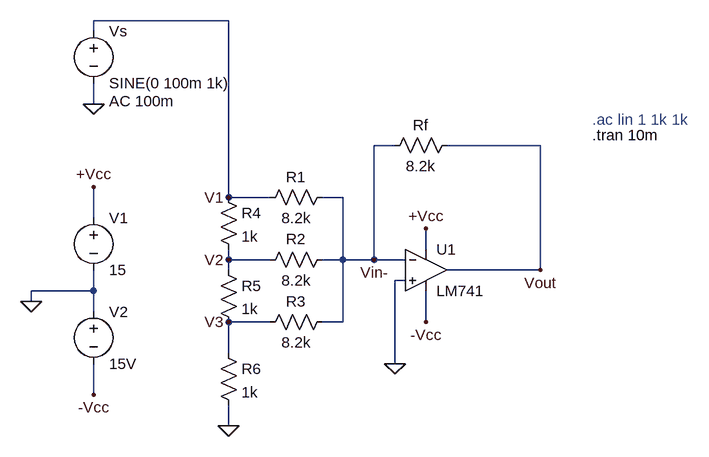
[diagram p0: schematic Adder.asc]
Adder.asc, the LTspice schematic file:
Version 4
SHEET 1 880 680
WIRE -32 -176 -240 -176
WIRE -240 -160 -240 -176
WIRE -240 -48 -240 -80
WIRE 224 16 192 16
WIRE 448 16 304 16
WIRE -32 96 -32 -176
WIRE 32 96 -32 96
WIRE 144 96 112 96
WIRE -240 128 -240 80
WIRE 272 176 272 144
WIRE -32 192 -32 176
WIRE 32 192 -32 192
WIRE 144 192 144 96
WIRE 144 192 112 192
WIRE 192 192 192 16
WIRE 192 192 144 192
WIRE 240 192 192 192
WIRE -32 208 -32 192
WIRE 448 208 448 16
WIRE 448 208 304 208
WIRE 240 224 224 224
WIRE -240 240 -240 208
WIRE -240 240 -336 240
WIRE -336 256 -336 240
WIRE -240 272 -240 240
WIRE 32 288 -32 288
WIRE 144 288 144 192
WIRE 144 288 112 288
WIRE 272 288 272 240
WIRE -32 336 -32 288
WIRE 224 352 224 224
WIRE -240 400 -240 352
WIRE -32 448 -32 416
FLAG -336 256 0
FLAG -240 80 +Vcc
FLAG 272 144 +Vcc
FLAG -240 400 -Vcc
FLAG 272 288 -Vcc
FLAG 448 208 Vout
FLAG 192 192 Vin-
FLAG 224 352 0
FLAG -32 448 0
FLAG -240 -48 0
FLAG -32 96 V1
FLAG -32 192 V2
FLAG -32 288 V3
SYMBOL Opamps\\LM741 272 144 R0
SYMATTR InstName U1
SYMBOL res 320 0 R90
WINDOW 0 0 56 VBottom 2
WINDOW 3 32 56 VTop 2
SYMATTR InstName Rf
SYMATTR Value 8.2k
SYMBOL res 128 176 R90
WINDOW 0 0 56 VBottom 2
WINDOW 3 32 56 VTop 2
SYMATTR InstName R2
SYMATTR Value 8.2k
SYMBOL voltage -240 -176 R0
WINDOW 123 24 124 Left 2
WINDOW 39 0 0 Left 0
SYMATTR Value2 AC 100m
SYMATTR InstName Vs
SYMATTR Value SINE(0 100m 1k)
SYMBOL voltage -240 112 R0
WINDOW 123 0 0 Left 0
WINDOW 39 0 0 Left 0
SYMATTR InstName V1
SYMATTR Value 15
SYMBOL voltage -240 256 R0
WINDOW 123 0 0 Left 0
WINDOW 39 0 0 Left 0
SYMATTR InstName V2
SYMATTR Value 15V
SYMBOL res 128 80 R90
WINDOW 0 0 56 VBottom 2
WINDOW 3 32 56 VTop 2
SYMATTR InstName R1
SYMATTR Value 8.2k
SYMBOL res 128 272 R90
WINDOW 0 0 56 VBottom 2
WINDOW 3 32 56 VTop 2
SYMATTR InstName R3
SYMATTR Value 8.2k
SYMBOL res -48 80 R0
SYMATTR InstName R4
SYMATTR Value 1k
SYMBOL res -48 192 R0
SYMATTR InstName R5
SYMATTR Value 1k
SYMBOL res -48 320 R0
SYMATTR InstName R6
SYMATTR Value 1k
TEXT 528 -24 Left 2 ;.ac lin 1 1k 1k
TEXT 528 0 Left 2 !.tran 10m

The netlist it stands for:
* Adder.asc
XU1 0 Vin- +Vcc -Vcc Vout LM741  ; pins In+ In- V+ V- OUT
Rf Vout Vin- 8.2k
R2 Vin- V2 8.2k
Vs V1 0 SINE(0 100m 1k) AC 100m
V1 +Vcc 0 15
V2 0 -Vcc 15V
R1 Vin- V1 8.2k
R3 Vin- V3 8.2k
R4 V1 V2 1k
R5 V2 V3 1k
R6 V3 0 1k
* .ac lin 1 1k 1k
.tran 10m
.lib LM741.lib
.backanno
.end